# Altium schematic sheet HV_DAC_8ch_FPGA.SchDoc: Fastino
size 420 x 297 mm; EDA_Number: ARTIQ; Projet: Fastino; Author: G.Kasprowicz; CompanyName: WUT ISE; DrawnBy: G.Kasprowicz; Organization: WUT ISE; Address1: PW ISE; Address2: Nowowiejska 15/19 00-665 Warsaw; Address3: gkasprow@gmail.com; DocumentNumber: 3; Revision: 2; SheetNumber: 4; SheetTotal: 12; ModifiedBy: -; CheckedDate: -; Title2: 3.3V FPGA banks; DivGrp: WUT ISE; Designer: G.Kasprowicz; ModifiedDate: -; ProjectName: Sensor Box
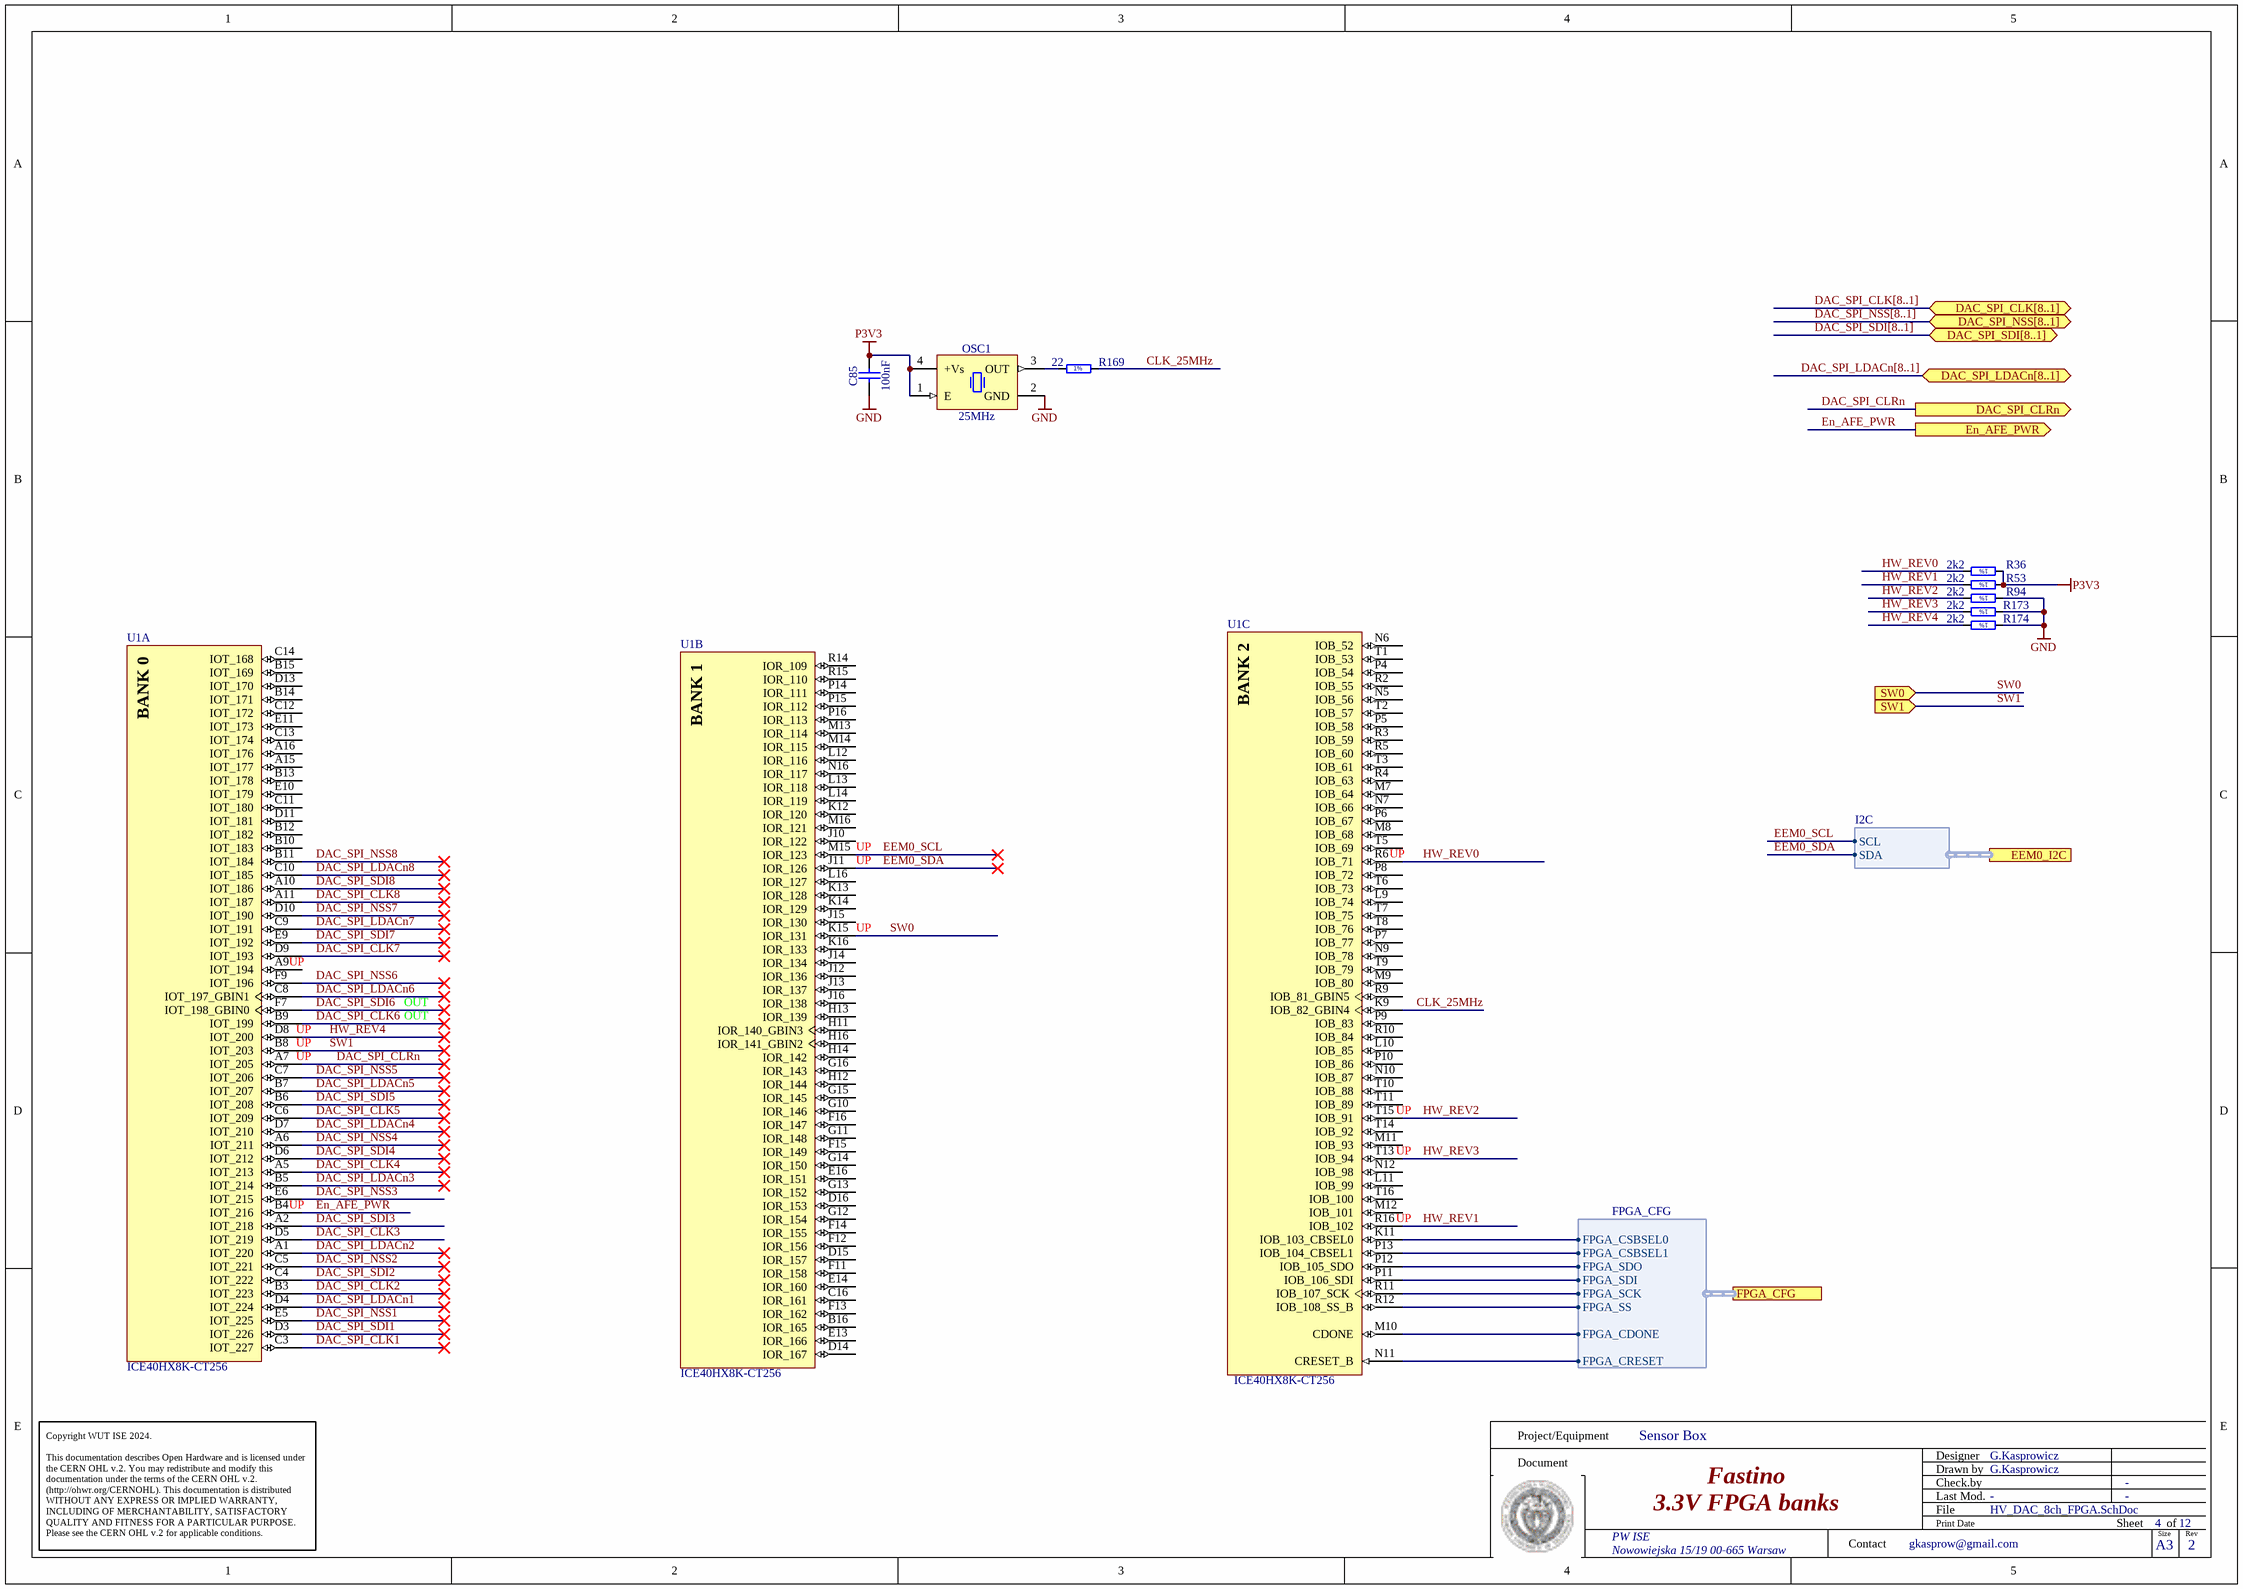
[diagram p0: HV_DAC_8ch_FPGA.SchDoc]

## Parts
C85  100nF  [CAPC1005X55N]
OSC1  25MHz  [OSC_IQD_CFPS-39]
R36  2k2  [RESC1005X40N]
R53  2k2  [RESC1005X40N]
R94  2k2  [RESC1005X40N]
R169  22  [RESC1005X40N]
R173  2k2  [RESC1005X40N]
R174  2k2  [RESC1005X40N]
U1  ICE40HX8K-CT256  [LATC-caBGA-256]  (parts A,B,C of 5)

## Ports
DAC_SPI_CLK[8..1] (bidir), DAC_SPI_CLRn (out), DAC_SPI_LDACn[8..1] (bidir), DAC_SPI_NSS[8..1] (bidir), DAC_SPI_SDI[8..1] (bidir), EEM0_I2C (harness I2C), En_AFE_PWR (out), FPGA_CFG (harness FPGA_CFG), SW0 (in), SW1 (in)

## Harnesses
FPGA_CFG: FPGA_CSBSEL0, FPGA_CSBSEL1, FPGA_SDO, FPGA_SDI, FPGA_SCK, FPGA_SS, FPGA_CDONE, FPGA_CRESET
I2C: SDA, SCL

## Nets
GND: C85.1 OSC1.2(GND) R94.1 R173.1 R174.1
P3V3: C85.2 OSC1.1(E) OSC1.4(+Vs) R36.1 R53.1
CLK_25MHz: R169.2 U1.K9(IOB_82_GBIN4)
DAC_SPI_CLK1: U1.C3(IOT_227)
DAC_SPI_CLK2: U1.B3(IOT_223)
DAC_SPI_CLK3: U1.D5(IOT_219)
DAC_SPI_CLK4: U1.A5(IOT_213)
DAC_SPI_CLK5: U1.C6(IOT_209)
DAC_SPI_CLK6: U1.B9(IOT_199)
DAC_SPI_CLK7: U1.D9(IOT_193)
DAC_SPI_CLK8: U1.A11(IOT_187)
DAC_SPI_CLRn: U1.A7(IOT_205) ; port DAC_SPI_CLRn
DAC_SPI_LDACn1: U1.D4(IOT_224)
DAC_SPI_LDACn2: U1.A1(IOT_220)
DAC_SPI_LDACn3: U1.B5(IOT_214)
DAC_SPI_LDACn4: U1.D7(IOT_210)
DAC_SPI_LDACn5: U1.B7(IOT_207)
DAC_SPI_LDACn6: U1.C8(IOT_197_GBIN1)
DAC_SPI_LDACn7: U1.C9(IOT_191)
DAC_SPI_LDACn8: U1.C10(IOT_185)
DAC_SPI_NSS1: U1.E5(IOT_225)
DAC_SPI_NSS2: U1.C5(IOT_221)
DAC_SPI_NSS3: U1.E6(IOT_215)
DAC_SPI_NSS4: U1.A6(IOT_211)
DAC_SPI_NSS5: U1.C7(IOT_206)
DAC_SPI_NSS6: U1.F9(IOT_196)
DAC_SPI_NSS7: U1.D10(IOT_190)
DAC_SPI_NSS8: U1.B11(IOT_184)
DAC_SPI_SDI1: U1.D3(IOT_226)
DAC_SPI_SDI2: U1.C4(IOT_222)
DAC_SPI_SDI3: U1.A2(IOT_218)
DAC_SPI_SDI4: U1.D6(IOT_212)
DAC_SPI_SDI5: U1.B6(IOT_208)
DAC_SPI_SDI6: U1.F7(IOT_198_GBIN0)
DAC_SPI_SDI7: U1.E9(IOT_192)
DAC_SPI_SDI8: U1.A10(IOT_186)
EEM0_SCL: U1.M15(IOR_123) ; port EEM0_I2C.SCL
EEM0_SDA: U1.J11(IOR_126) ; port EEM0_I2C.SDA
En_AFE_PWR: U1.B4(IOT_216) ; port En_AFE_PWR
HW_REV0: R36.2 U1.R6(IOB_71)
HW_REV1: R53.2 U1.R16(IOB_102)
HW_REV2: R94.2 U1.T15(IOB_91)
HW_REV3: R173.2 U1.T13(IOB_94)
HW_REV4: R174.2 U1.D8(IOT_200)
SW0: U1.K15(IOR_131) ; port SW0
SW1: U1.B8(IOT_203) ; port SW1
NetOSC1_3: OSC1.3(OUT) R169.1
NetU1_K11: U1.K11(IOB_103_CBSEL0) ; port FPGA_CFG.FPGA_CSBSEL0
NetU1_M10: U1.M10(CDONE) ; port FPGA_CFG.FPGA_CDONE
NetU1_N11: U1.N11(CRESET_B) ; port FPGA_CFG.FPGA_CRESET
NetU1_P11: U1.P11(IOB_106_SDI) ; port FPGA_CFG.FPGA_SDI
NetU1_P12: U1.P12(IOB_105_SDO) ; port FPGA_CFG.FPGA_SDO
NetU1_P13: U1.P13(IOB_104_CBSEL1) ; port FPGA_CFG.FPGA_CSBSEL1
NetU1_R11: U1.R11(IOB_107_SCK) ; port FPGA_CFG.FPGA_SCK
NetU1_R12: U1.R12(IOB_108_SS_B) ; port FPGA_CFG.FPGA_SS

Not connected (* = marked no-connect by the designer): U1 A9(IOT_194) A15(IOT_177) A16(IOT_176) B10(IOT_183) B12(IOT_182) B13(IOT_178) B14(IOT_171) B15(IOT_169) B16(IOR_165) C11(IOT_180) C12(IOT_172) C13(IOT_174) C14(IOT_168) C16(IOR_161) D11(IOT_181) D13(IOT_170) D14(IOR_167) D15(IOR_157) D16(IOR_153) E10(IOT_179) E11(IOT_173) E13(IOR_166) E14(IOR_160) E16(IOR_151) F11(IOR_158) F12(IOR_156) F13(IOR_162) F14(IOR_155) F15(IOR_149) F16(IOR_147) G10(IOR_146) G11(IOR_148) G12(IOR_154) G13(IOR_152) G14(IOR_150) G15(IOR_145) G16(IOR_143) H11(IOR_140_GBIN3) H12(IOR_144) H13(IOR_139) H14(IOR_142) H16(IOR_141_GBIN2) J10(IOR_122) J12(IOR_136) J13(IOR_137) J14(IOR_134) J15(IOR_130) J16(IOR_138) K12(IOR_120) K13(IOR_128) K14(IOR_129) K16(IOR_133) L9(IOB_74) L10(IOB_85) L11(IOB_99) L12(IOR_116) L13(IOR_118) L14(IOR_119) L16(IOR_127) M7(IOB_64) M8(IOB_68) M9(IOB_80) M11(IOB_93) M12(IOB_101) M13(IOR_114) M14(IOR_115) M16(IOR_121) N5(IOB_56) N6(IOB_52) N7(IOB_66) N9(IOB_78) N10(IOB_87) N12(IOB_98) N16(IOR_117) P4(IOB_54) P5(IOB_58) P6(IOB_67) P7(IOB_77) P8(IOB_72) P9(IOB_83) P10(IOB_86) P14(IOR_111) P15(IOR_112) P16(IOR_113) R2(IOB_55) R3(IOB_59) R4(IOB_63) R5(IOB_60) R9(IOB_81_GBIN5) R10(IOB_84) R14(IOR_109) R15(IOR_110) T1(IOB_53) T2(IOB_57) T3(IOB_61) T5(IOB_69) T6(IOB_73) T7(IOB_75) T8(IOB_76) T9(IOB_79) T10(IOB_88) T11(IOB_89) T14(IOB_92) T16(IOB_100)

## Buses and harness runs
bus DAC_SPI_CLK[8..1] = port DAC_SPI_CLK[8..1]
bus DAC_SPI_LDACn[8..1] = port DAC_SPI_LDACn[8..1]
bus DAC_SPI_NSS[8..1] = port DAC_SPI_NSS[8..1]
bus DAC_SPI_SDI[8..1] = port DAC_SPI_SDI[8..1]

## Notes on the sheet
- (near U1) UP
- OUT
- Project/Equipment
- Document
- Designer
- Drawn by
- Check.by
- Copyright WUT ISE 2024.
  This documentation describes Open Hardware and is licensed under the CERN OHL v.2. You may redistribute and modify this documentation under the terms of the CERN OHL v.2. (http://ohwr.org/CERNOHL). This documentation is distributed WITHOUT ANY EXPRESS OR IMPLIED WARRANTY, INCLUDING OF MERCHANTABILITY, SATISFACTORY QUALITY AND FITNESS FOR A PARTICULAR PURPOSE. Please see the CERN OHL v.2 for applicable conditions.
- Contact
- File
- Last Mod.
- Print Date
- Sheet
- Size
- A3
- of
- Rev
- (in symbol CMP-0962-00001-1, part A) BANK 0
- (in symbol CMP-0962-00001-1, part B) BANK 1
- (in symbol CMP-0962-00001-1, part C) BANK 2
- (in symbol R0402_2K2_1%_0.0625W_100PPM) 1%
- (in symbol R0402_22R_1%_0.0625W_100PPM) 1%

## Library data of the parts
C85 = CC0402_100NF_16V_10%_X5R: Non-polarised capacitor; Part Description: SMD Multilayer Chip Ceramic Capacitor; Manufacturer: GENERIC; Manufacturer1 Part Number: GRM155R61C104KA88D; Voltage: 16V; TC: X5R; Tolerance: ±10%; Part Number: CC0402_100NF_16V_10%_X5R; Component Kind: Standard; Component Type: Standard; Pin Count: 2; Value: 100nF; Status: None; Manufacturer Part Number: CC0402_100NF_16V_10%_X5R; Case: 0402; Mounted: Yes; Socket: No; SMD: Yes; Sense: No; Manufacturer1 Example: MURATA; Manufacturer1 ComponentHeight: 0.55mm; HelpURL: \\cern.ch\dfs\Applications\Altium\Datasheets\CC0402_X5R_MURATA_GRM.pdf; Author: CERN DEM JLC; CreateDate: 10.12.2013; LatestRevisionDate: 10.12.2013
OSC1 = OSC_25MHZ_IQD_LFSPXO025165: Oscillator 4 pins 1=E 2=GND 3=OUT 4=+Vs; Part Description: 3.3V, ±50ppm, 15pF, -40 to 85°C, CMOS Surface Mount Clock Oscillator (CFPS-39 Series); Manufacturer: IQD FREQUENCY PRODUCTS; PressFit: No; Bonding: No; Part Number: OSC_25MHZ_IQD_LFSPXO025165; Component Kind: Standard; Component Type: Standard; PackageDescription: Oscillator, Corner Concave, 2.20mm Pitch, 4 Pins, 2.70mm L X 3.40mm W X 1.20mm H, CFPS-39 Series; Value: 25MHz; Manufacturer Part Number: LFSPXO025165; Pin Count: 4; Mounted: Yes; Socket: No; SMD: Yes; Sense: No; ComponentHeight: 1.2mm; HelpURL: \\cern.ch\dfs\Applications\Altium\Datasheets\OSC_IQD_LFSPXO025165.pdf; Author: CERN DEM JLC; CreateDate: 02.12.2010; LatestRevisionDate: 03.11.2016
R36 R53 R94 R173 R174 = R0402_2K2_1%_0.0625W_100PPM: Resistor - 1%; Part Description: General Purpose Thick Film Chip Resistor; Manufacturer: GENERIC; Manufacturer1 Part Number: 232270672202L; TC: ±100ppm/°C; Table: Resistors SMD; Part Number: R0402_2K2_1%_0.0625W_100PPM; Component Kind: Standard; Component Type: Standard; Pin Count: 2; Value: 2k2; Status: Not recommended; Power: 0.0625W; Tolerance: ±1%; Manufacturer Part Number: R0402_2K2_1%_0.0625W_100PPM; Case: 0402; Mounted: Yes; Socket: No; SMD: Yes; Manufacturer1 Example: YAGEO PHYCOMP; Manufacturer1 ComponentHeight: 0.4mm; HelpURL: \\cern.ch\dfs\Applications\Altium\Datasheets\R0402_Phycomp_RC0402.pdf; Author: CERN DEM JLC; CreateDate: 2007-12-03; LatestRevisionDate: 2012-10-17
R169 = R0402_22R_1%_0.0625W_100PPM: Resistor - 1%; Part Description: General Purpose Thick Film Chip Resistor; Manufacturer: GENERIC; Manufacturer1 Part Number: 232270672209L; TC: ±100ppm/°C; PressFit: No; Part Number: R0402_22R_1%_0.0625W_100PPM; Component Kind: Standard; Component Type: Standard; Pin Count: 2; Value: 22; Status: Not Recommended; Power: 0.0625W; Tolerance: ±1%; Manufacturer Part Number: R0402_22R_1%_0.0625W_100PPM; Case: 0402; Mounted: Yes; Sense: No; Socket: No; SMD: Yes; Manufacturer1 Example: YAGEO PHYCOMP; Manufacturer1 ComponentHeight: 0.4mm; HelpURL: \\cern.ch\dfs\Applications\Altium\Datasheets\R0402_Phycomp_RC0402.pdf; Author: CERN DEM JLC; CreateDate: 03/12/2007; LatestRevisionDate: 17/10/2012
U1 = CMP-0962-00001-1: iCE40 HX8K Series FPGA Family, 7680 Logic Cells, 1.2 V Core, 128 K Embedded RAM Bits, 256-ball caBGA, Pb-Free, Tray; Manufacturer: Lattice Semiconductor; Supply Voltage: 1.2V; Phase-Locked Loops: 2; Logic Cells: 7680; Embedded RAM Bits: 128K; PackageReference: caBGA-256; PackageDescription: 256-Ball Chip Array Ball Grid Array, Body 14 x 14 mm, Pitch 0.8 mm; RoHS: TRUE; Packing: Tray; Mounting Technology: Surface Mount; ComponentLink3URL: http://www.latticesemi.com/lit/docs/package/pkg.pdf; ComponentLink1Description: Manufacturer URL; ComponentLink3Description: Package Specification; Code_JEDEC: MO-275; PackageVersion: Rev. 03.9, 02/2013; ComponentLink1URL: http://www.latticesemi.com/en; ComponentLink2URL: http://www.latticesemi.com/~/media/Documents/DataSheets/iCE/iCE40LPHXFamilyDataSheet.pdf; Manufacturer Part Number: ICE40HX8K-CT256; ComponentLink2Description: Datasheet; DatasheetVersion: Rev. 02.9